# Altium schematic sheet 平衡车.SchDoc
size A3; SheetNumber: 1; SheetTotal: 1
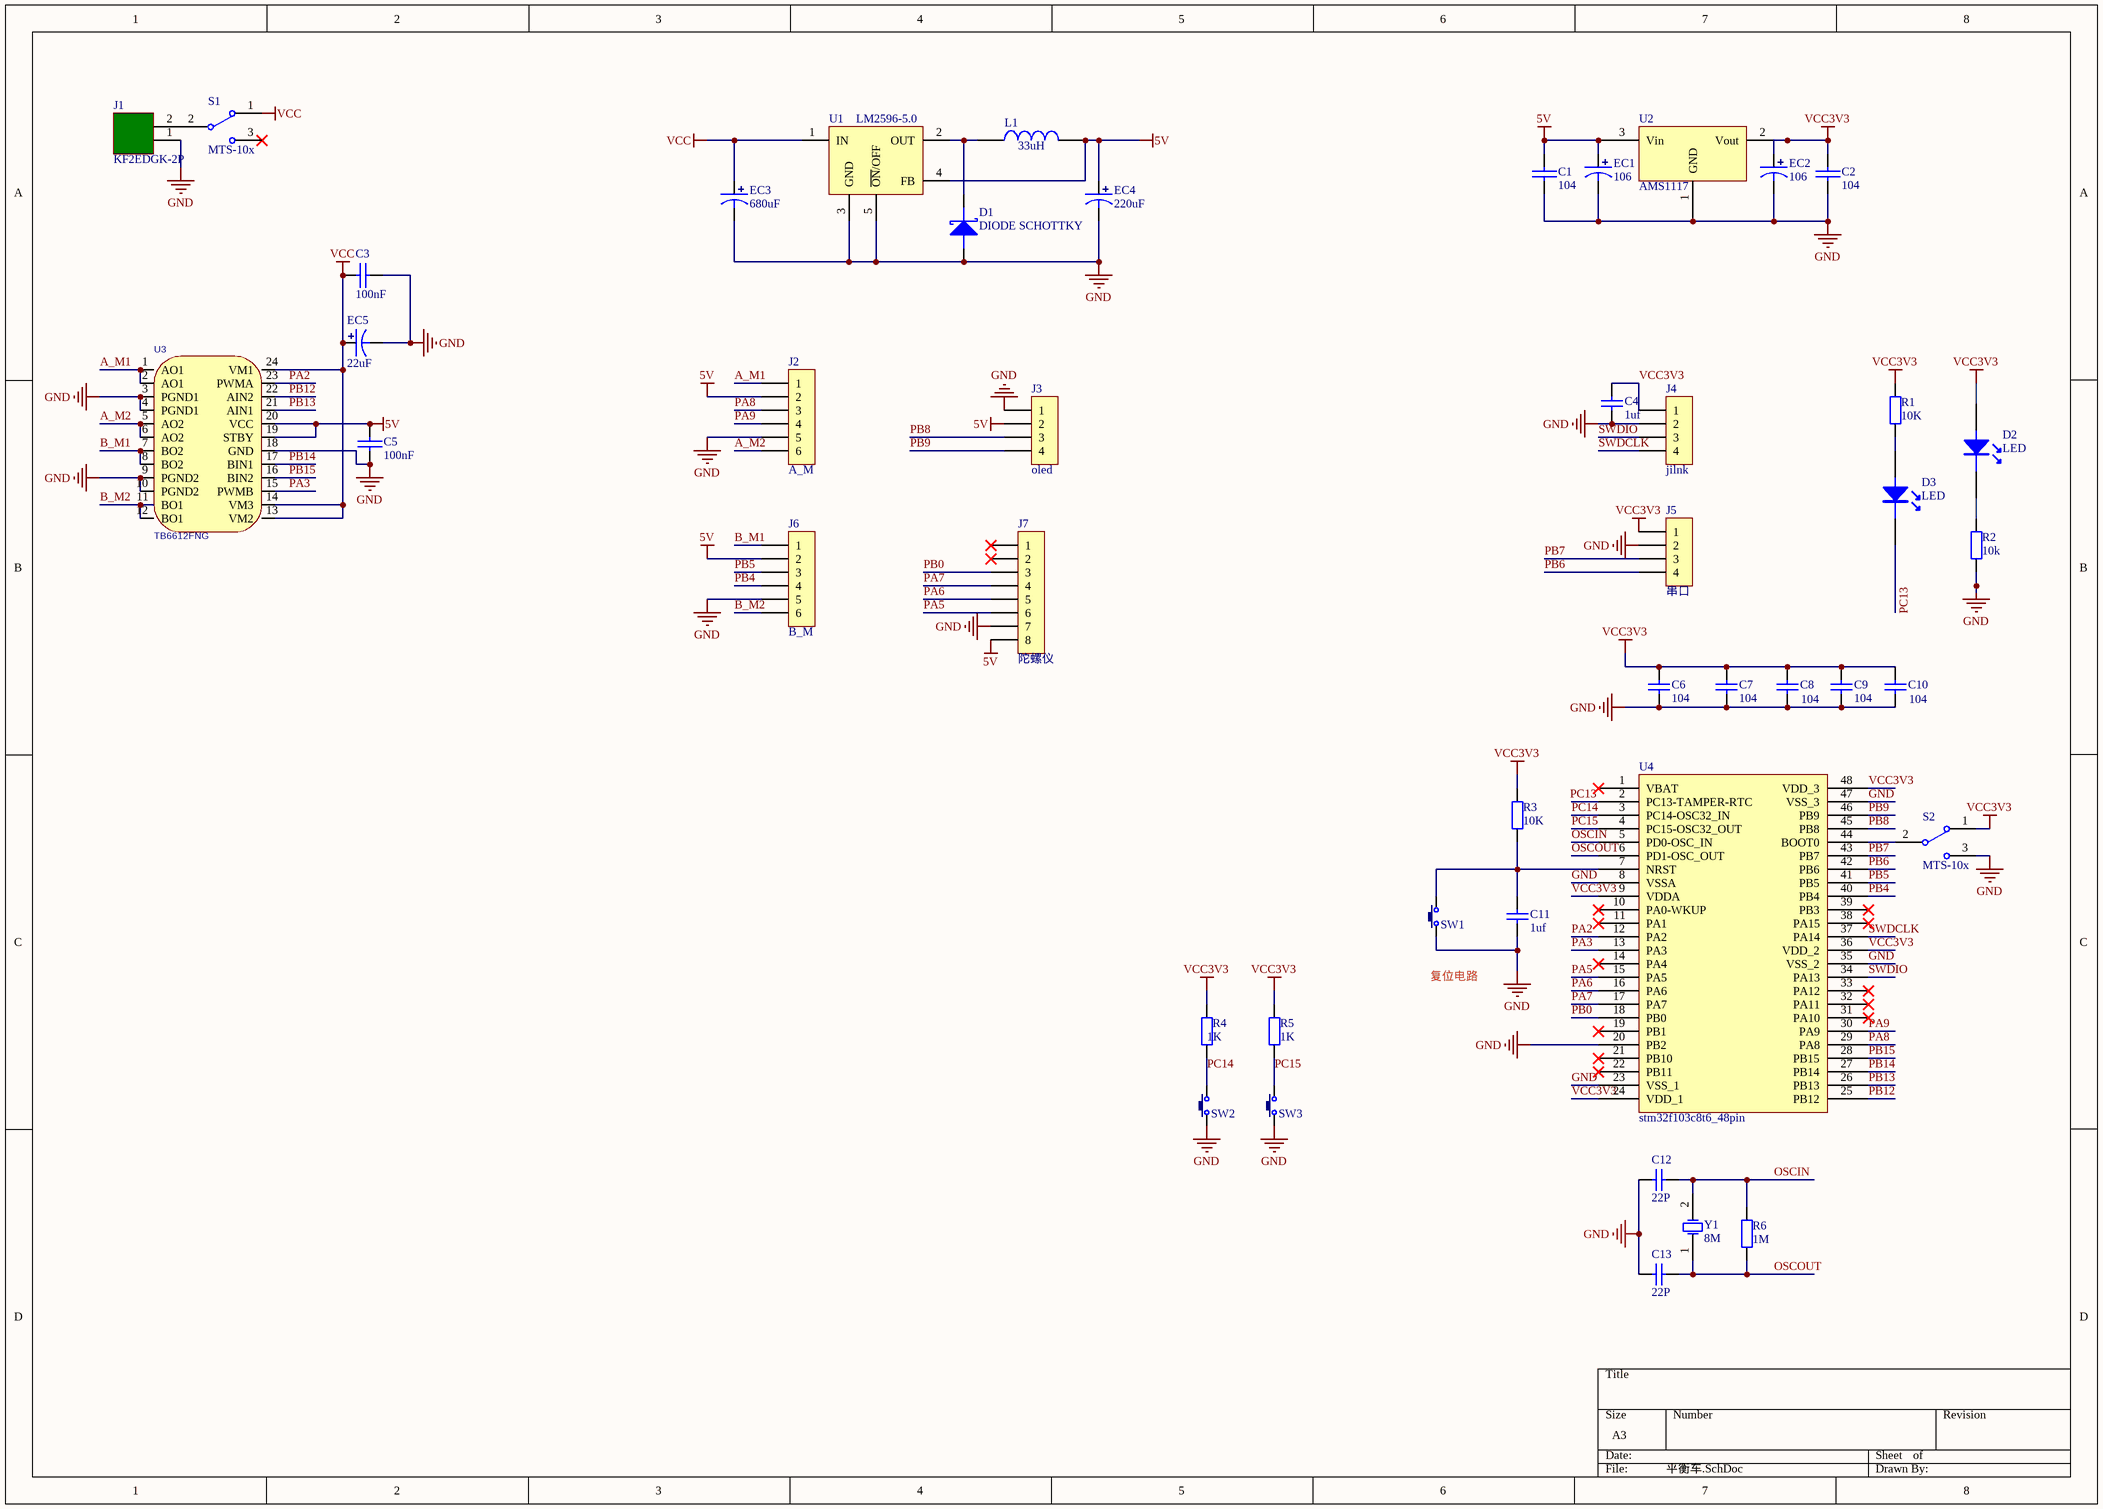
[diagram p0: 平衡车.SchDoc]

## Parts
C1  104  [0805C]
C2  104  [0805C]
C3  100nF  [0805C]
C4  1uf  [0805R]
C5  100nF  [0805C]
C6  104  [0805R]
C7  104  [0805R]
C8  104  [0805R]
C9  104  [0805R]
C10  104  [0805R]
C11  1uf  [0805R]
C12  22P  [0805R]
C13  22P  [0805R]
D1  DIODE SCHOTTKY  [SMB/DO-214AA]
D2  LED  [LED 0805G]
D3  LED  [LED 0805G]
EC1  106  [DIP-EC2.5X5X11]
EC2  106  [DIP-EC2.5X5X11]
EC3  680uF  [DIP-EC5.0X10X12.5]
EC4  220uF  [DIP-EC2.5X5X11]
EC5  22uF  [DIP-EC2.5X5X11]
J1  KF2EDGK-2P  [KF2EDGK5.0-2P]
J2  A_M  [Fe-HDR1X6/2.54-S]
J3  oled  [Fe-HDR1X4/2.54-S]
J4  jilnk  [Fe-HDR1X4/2.54-S]
J5  串口  [Fe-HDR1X4/2.54-S]
J6  B_M  [Fe-HDR1X6/2.54-S]
J7  陀螺仪  [Fe-HDR1X8/2.54-S]
L1  33uH  [CDRH74]
R1  10K  [0805R]
R2  10k  [0805R]
R3  10K  [0805R]
R4  1K  [0805R]
R5  1K  [0805R]
R6  1M  [0805R]
S1  MTS-10x  [MTS-10x]
S2  MTS-10x  [MTS-10x]
SW1  3x6x5  [TSW SMD-3*6*2.5]  (value not drawn)
SW2  3x6x5  [TSW SMD-3*6*2.5]  (value not drawn)
SW3  3x6x5  [TSW SMD-3*6*2.5]  (value not drawn)
U1  LM2596-5.0  [TO263-5A]
U2  AMS1117  [SOT223]
U3  TB6612FNG  [SSOP-24_L8.3-W5.6-P0.65-LS7.6-BL]
U4  stm32f103c8t6_48pin  [LQFP-48_M]
Y1  8M  [OSC HC-49U]

## Nets
5V: C1.1 C5.2 EC1.1 EC4.1 J2.2 J3.2 J6.2 J7.8 L1.2 U1.4(FB) U2.3(Vin) U3.19(STBY) U3.20(VCC)
GND: C1.2 C2.2 C3.2 C4.1 C5.1 C6.1 C7.1 C8.1 C9.1 C10.1 C11.1 C12.2 C13.2 D1.A EC1.2 EC2.2 EC3.2 EC4.2 EC5.2 J1.1 J2.5 J3.1 J4.2 J5.2 J6.5 J7.7 R2.2 S2.3 SW1.1 SW2.1 SW3.1 U1.3(GND) U1.5(~{ON}/OFF) U2.1(GND) U3.3(PGND1) U3.4(PGND1) U3.9(PGND2) U3.10(PGND2) U3.18(GND) U4.8(VSSA) U4.20(PB2) U4.23(VSS_1) U4.35(VSS_2) U4.47(VSS_3)
VCC: C3.1 EC3.1 EC5.1 S1.1 U1.1(IN) U3.13(VM2) U3.14(VM3) U3.24(VM1)
VCC3V3: C2.1 C4.2 C6.2 C7.2 C8.2 C9.2 C10.2 D2.1 EC2.1 J4.1 J5.1 R1.1 R3.2 R4.2 R5.2 S2.1 U2.2(Vout) U4.9(VDDA) U4.24(VDD_1) U4.36(VDD_2) U4.48(VDD_3)
A_M1: J2.1 U3.1(AO1) U3.2(AO1)
A_M2: J2.6 U3.5(AO2) U3.6(AO2)
B_M1: J6.1 U3.7(BO2) U3.8(BO2)
B_M2: J6.6 U3.11(BO1) U3.12(BO1)
OSCIN: C12.1 R6.2 U4.5(PD0-OSC_IN) Y1.2(OSC2)
OSCOUT: C13.1 R6.1 U4.6(PD1-OSC_OUT) Y1.1(OSC1)
PA2: U3.23(PWMA) U4.12(PA2)
PA3: U3.15(PWMB) U4.13(PA3)
PA5: J7.6 U4.15(PA5)
PA6: J7.5 U4.16(PA6)
PA7: J7.4 U4.17(PA7)
PA8: J2.3 U4.29(PA8)
PA9: J2.4 U4.30(PA9)
PB0: J7.3 U4.18(PB0)
PB4: J6.4 U4.40(PB4)
PB5: J6.3 U4.41(PB5)
PB6: J5.4 U4.42(PB6)
PB7: J5.3 U4.43(PB7)
PB8: J3.3 U4.45(PB8)
PB9: J3.4 U4.46(PB9)
PB12: U3.22(AIN2) U4.25(PB12)
PB13: U3.21(AIN1) U4.26(PB13)
PB14: U3.17(BIN1) U4.27(PB14)
PB15: U3.16(BIN2) U4.28(PB15)
PC13: D3.2 U4.2(PC13-TAMPER-RTC)
PC14: R4.1 SW2.2 U4.3(PC14-OSC32_IN)
PC15: R5.1 SW3.2 U4.4(PC15-OSC32_OUT)
SWDCLK: J4.4 U4.37(PA14)
SWDIO: J4.3 U4.34(PA13)
NetC11_2: C11.2 R3.1 SW1.2 U4.7(NRST)
NetD1_K: D1.K L1.1 U1.2(OUT)
NetD2_2: D2.2 R2.1
NetD3_1: D3.1 R1.2
NetJ1_2: J1.2 S1.2
NetS2_2: S2.2 U4.44(BOOT0)

Not connected (* = marked no-connect by the designer): J7 1* 2*; S1 3*; U4 1(VBAT)* 10(PA0-WKUP)* 11(PA1)* 14(PA4)* 19(PB1)* 21(PB10)* 22(PB11)* 31(PA10)* 32(PA11)* 33(PA12)* 38(PA15)* 39(PB3)*

## Notes on the sheet
- (near SW1) 复位电路

## Library data of the parts
C1-C3 C5 = CAP: 无极性电容
C4 C11 = Cap: Value: 104; Published: 8-Jun-2000; LatestRevisionDate: 17-Jul-2002; LatestRevisionNote: Re-released for DXP Platform.; Publisher: Altium Limited
C6-C10 = Cap: Published: 8-Jun-2000; LatestRevisionDate: 17-Jul-2002; LatestRevisionNote: Re-released for DXP Platform.; Publisher: Altium Limited; Value: 104
C12 C13 = Cap: Capacitor; Value: 104; Published: 8-Jun-2000; LatestRevisionDate: 17-Jul-2002; LatestRevisionNote: Re-released for DXP Platform.; Publisher: Altium Limited
D1 = DIODE SCHOTTKY: 肖特基二极管
EC1-EC5 = DIP_ECAP: 直插电解电容
J2 J6 = Female HDR1X6
J3-J5 = Female HDR1X4
J7 = Female HDR1X8
L1 = INDUCTOR
R1-R5 = Res2: Published: 8-Jun-2000; LatestRevisionDate: 17-Jul-2002; LatestRevisionNote: Re-released for DXP Platform.; Publisher: Altium Limited
R6 = Res2: Resistor; Published: 8-Jun-2000; LatestRevisionDate: 17-Jul-2002; LatestRevisionNote: Re-released for DXP Platform.; Publisher: Altium Limited
S1 S2 = MTS-10x: MTS10x系列3脚扭子开关; 版权归属: 源创客; BOM名称: MTS10x系列3脚扭子开关; 学习资源: www.ooocke.com
SW1-SW3 = TSW 3x6: 3x6轻触开关; 版权归属: 源创客; BOM名称: 3x6轻触开关; 学习资源: www.ooocke.com
U1 = LM2596-5.0: DC降压芯片
U2 = AMS1117: 三端稳压芯片
U3 = TB6612FNG: 联系卖家，免费查找封装: 唯一出售店铺网址https://shop463601444.taobao.com; BOM名称: TB6612FNG
Y1 = XTAL: Crystal Oscillator; Published: 8-Jun-2000; LatestRevisionDate: 17-Jul-2002; LatestRevisionNote: Re-released for DXP Platform.; Publisher: Altium Limited